# EAGLE schematic GPSClock_Display (EAGLE 6.5.0)
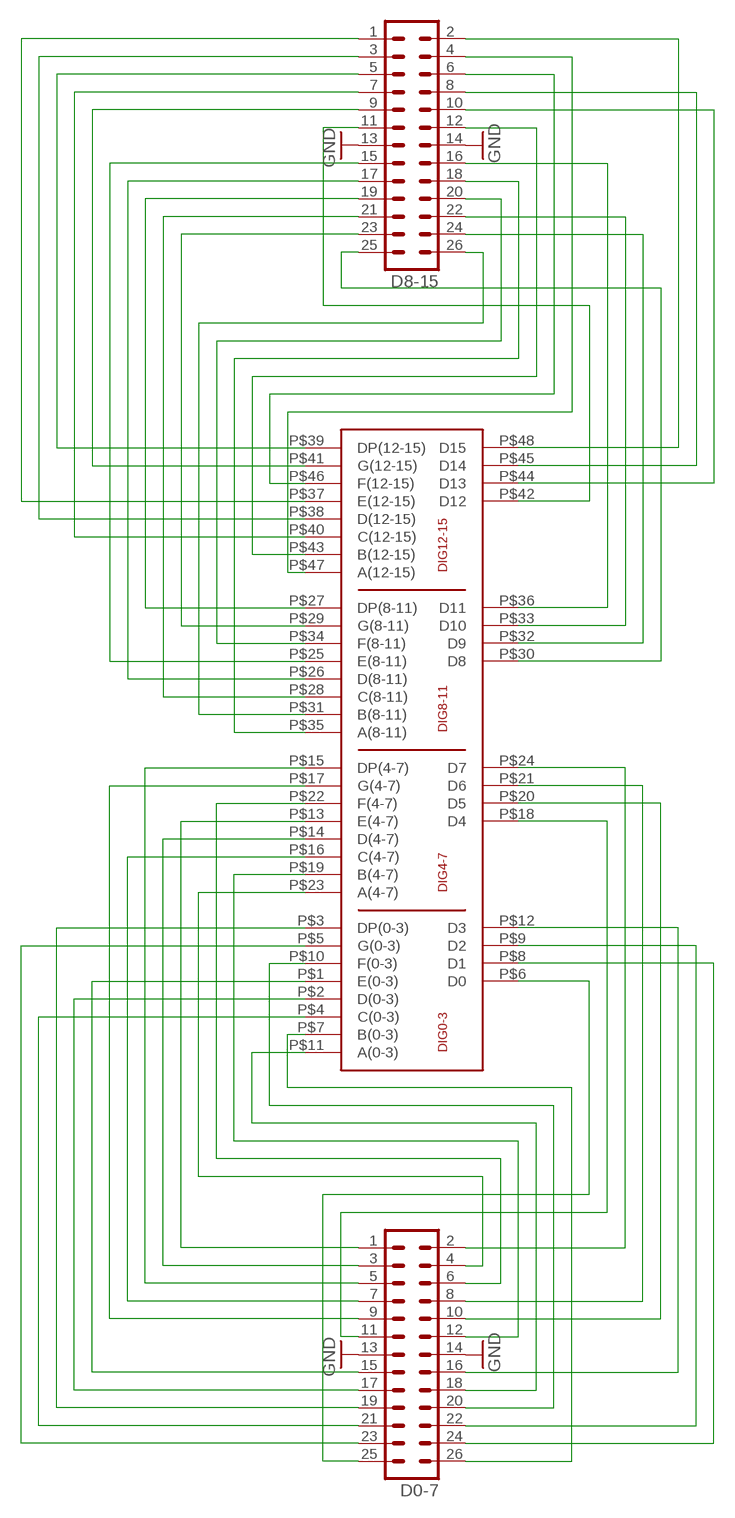
[diagram p0: schematic, sheet 1]

## Parts
D0-7  MA13-2  [MA13-2]
D8-15  MA13-2  [MA13-2]
U$1  4X7X4_SEG  [4X7X4_SEG]

## Nets
GND: D0-7.13 D0-7.14 D8-15.13 D8-15.14
N$1: D0-7.1 U$1.P$13(E(4-7))
N$2: D0-7.3 U$1.P$14(D(4-7))
N$3: D0-7.5 U$1.P$15(DP(4-7))
N$4: D0-7.7 U$1.P$16(C(4-7))
N$5: D0-7.9 U$1.P$17(G(4-7))
N$6: D0-7.11 U$1.P$18(D4)
N$7: D0-7.15 U$1.P$1(E(0-3))
N$8: D0-7.17 U$1.P$2(D(0-3))
N$9: D0-7.19 U$1.P$3(DP(0-3))
N$10: D0-7.21 U$1.P$4(C(0-3))
N$11: D0-7.23 U$1.P$5(G(0-3))
N$12: D0-7.25 U$1.P$6(D0)
N$13: D0-7.2 U$1.P$24(D7)
N$14: D0-7.4 U$1.P$23(A(4-7))
N$15: D0-7.6 U$1.P$22(F(4-7))
N$16: D0-7.8 U$1.P$21(D6)
N$17: D0-7.10 U$1.P$20(D5)
N$18: D0-7.12 U$1.P$19(B(4-7))
N$19: D0-7.16 U$1.P$12(D3)
N$20: D0-7.18 U$1.P$11(A(0-3))
N$21: D0-7.20 U$1.P$10(F(0-3))
N$22: D0-7.22 U$1.P$9(D2)
N$23: D0-7.24 U$1.P$8(D1)
N$24: D0-7.26 U$1.P$7(B(0-3))
N$25: D8-15.25 U$1.P$30(D8)
N$26: D8-15.23 U$1.P$29(G(8-11))
N$27: D8-15.21 U$1.P$28(C(8-11))
N$28: D8-15.19 U$1.P$27(DP(8-11))
N$29: D8-15.17 U$1.P$26(D(8-11))
N$30: D8-15.15 U$1.P$25(E(8-11))
N$31: D8-15.11 U$1.P$42(D12)
N$32: D8-15.9 U$1.P$41(G(12-15))
N$33: D8-15.7 U$1.P$40(C(12-15))
N$34: D8-15.5 U$1.P$39(DP(12-15))
N$35: D8-15.3 U$1.P$38(D(12-15))
N$36: D8-15.1 U$1.P$37(E(12-15))
N$37: D8-15.26 U$1.P$31(B(8-11))
N$38: D8-15.24 U$1.P$32(D9)
N$39: D8-15.22 U$1.P$33(D10)
N$40: D8-15.20 U$1.P$34(F(8-11))
N$41: D8-15.18 U$1.P$35(A(8-11))
N$42: D8-15.16 U$1.P$36(D11)
N$43: D8-15.12 U$1.P$43(B(12-15))
N$44: D8-15.10 U$1.P$44(D13)
N$45: D8-15.8 U$1.P$45(D14)
N$46: D8-15.6 U$1.P$46(F(12-15))
N$47: D8-15.4 U$1.P$47(A(12-15))
N$48: D8-15.2 U$1.P$48(D15)

## Library data of the parts
D0-7 D8-15 = con-lstb:MA13-2: PIN HEADER; OC_FARNELL: unknown; OC_NEWARK: unknown
U$1 = 4x7x4_SEG:4X7X4_SEG